# EAGLE design p8x-regbank-card (EAGLE 9.6.2)
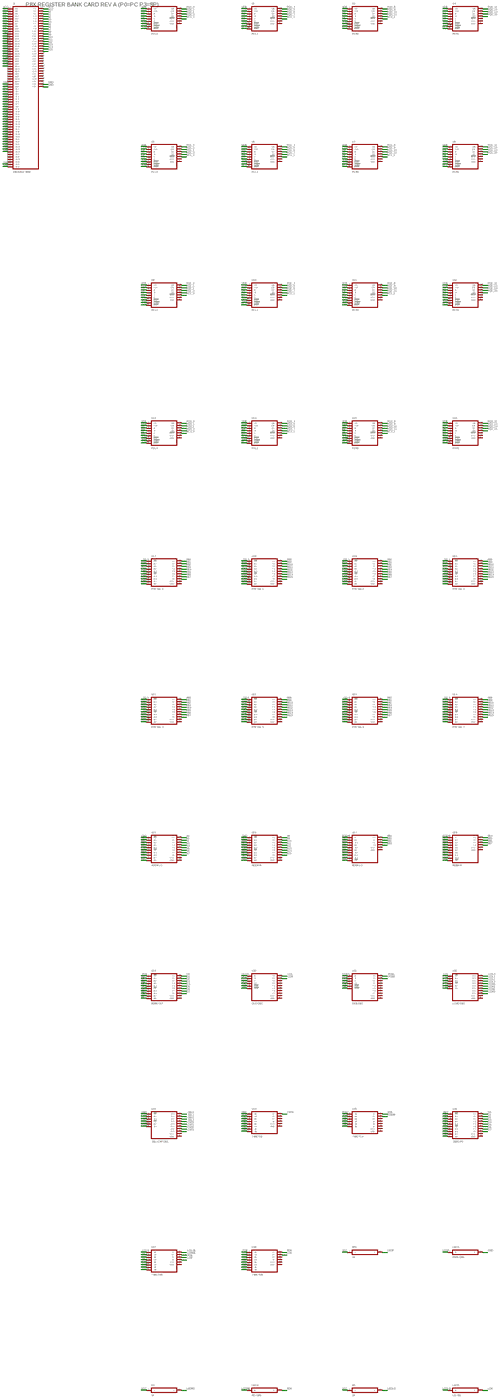
[diagram p0: schematic, sheet 1, overview]
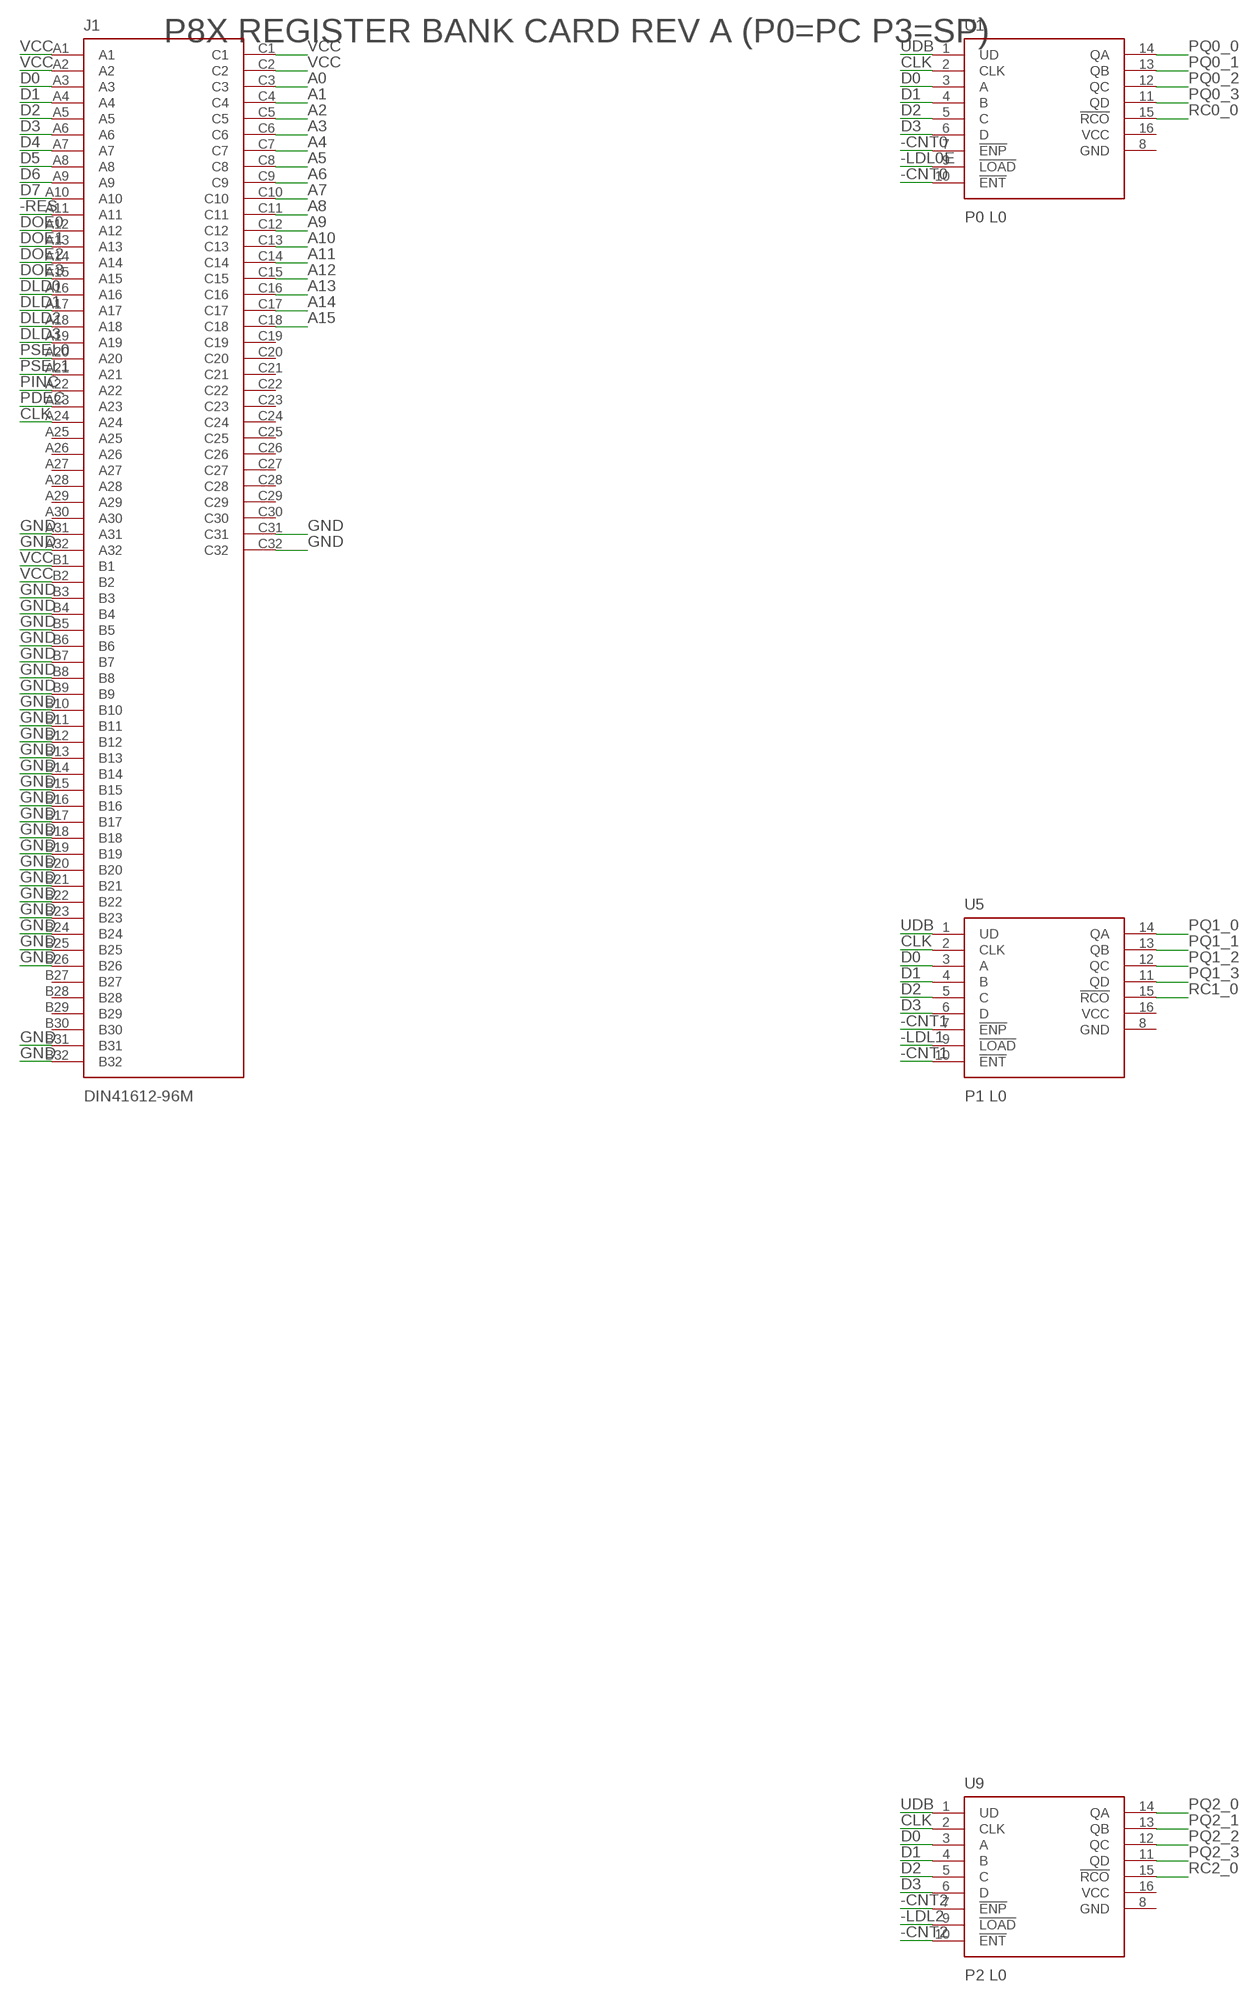
[diagram p1: schematic, sheet 1, part 1 of 5]
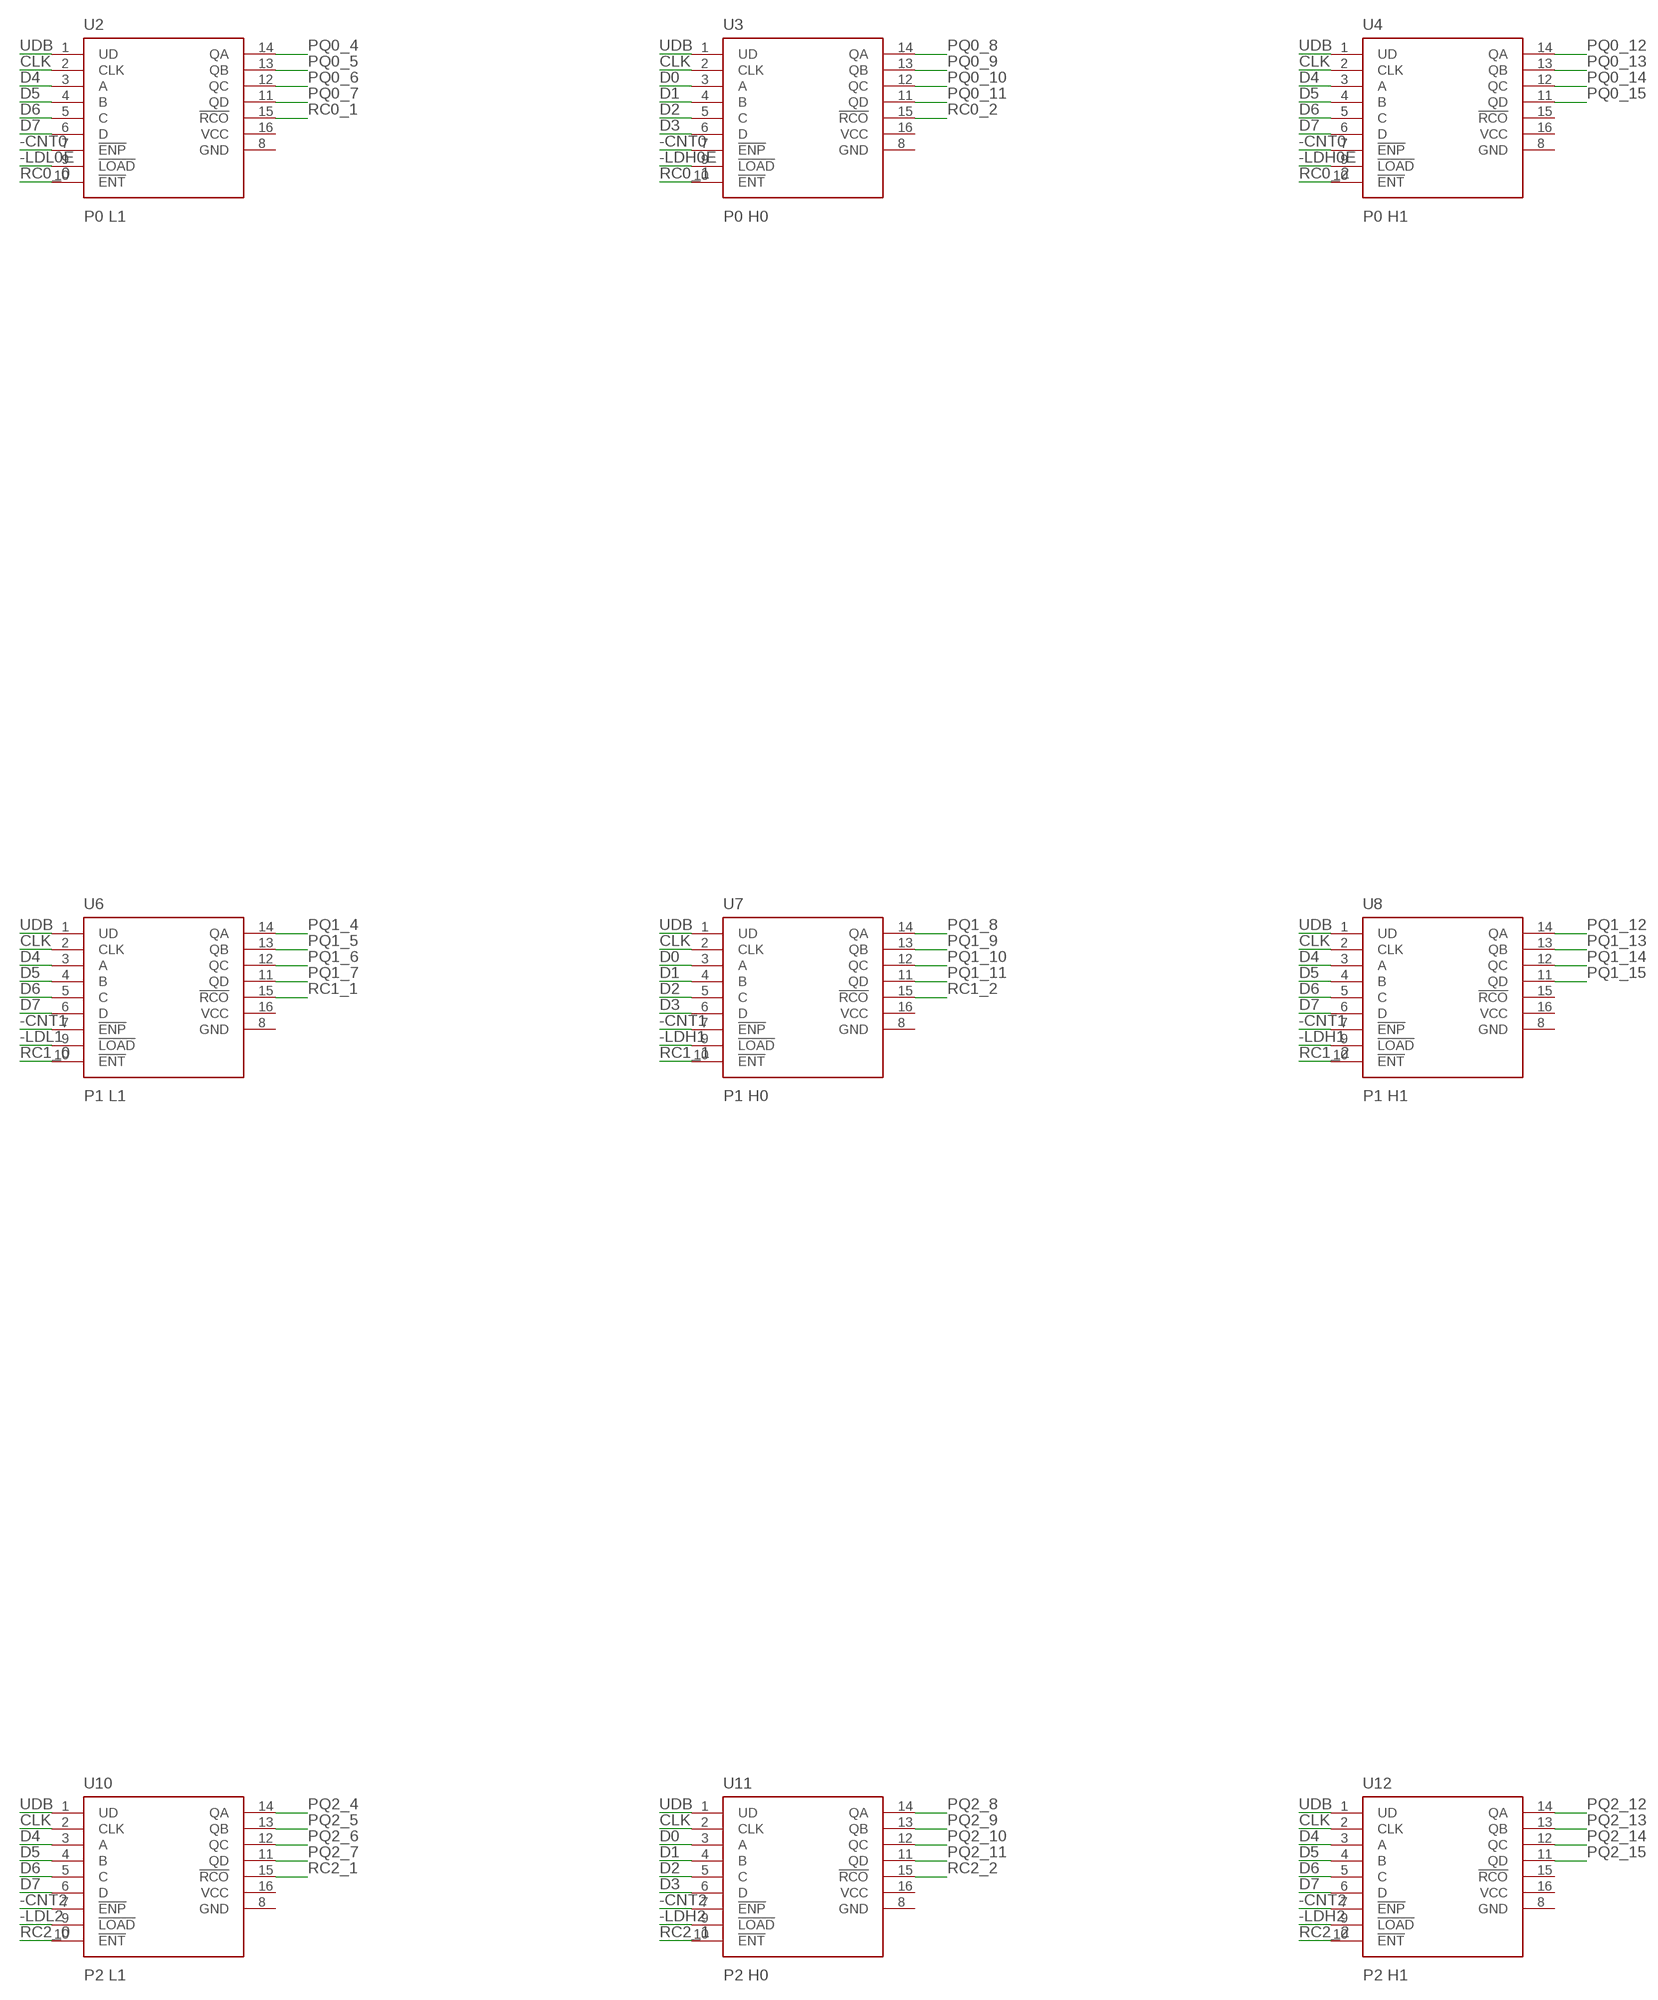
[diagram p2: schematic, sheet 1, part 2 of 5]
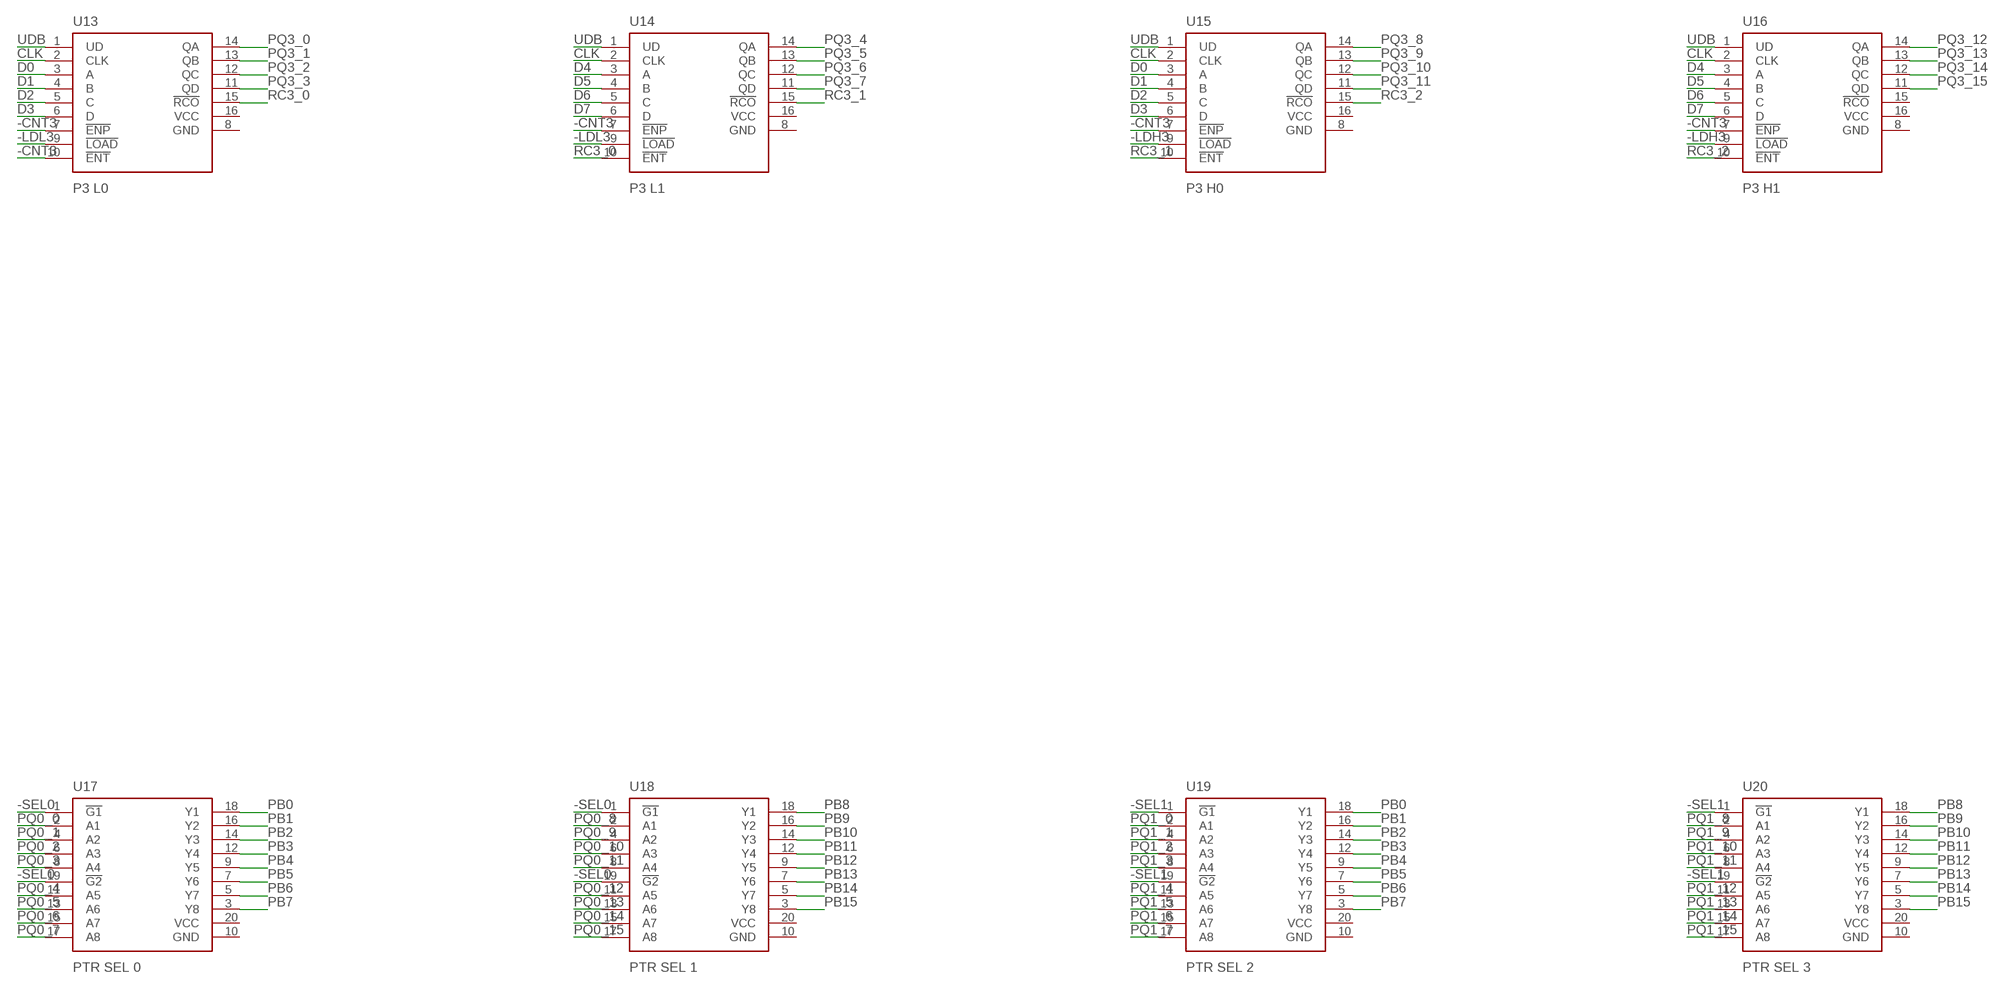
[diagram p3: schematic, sheet 1, part 3 of 5]
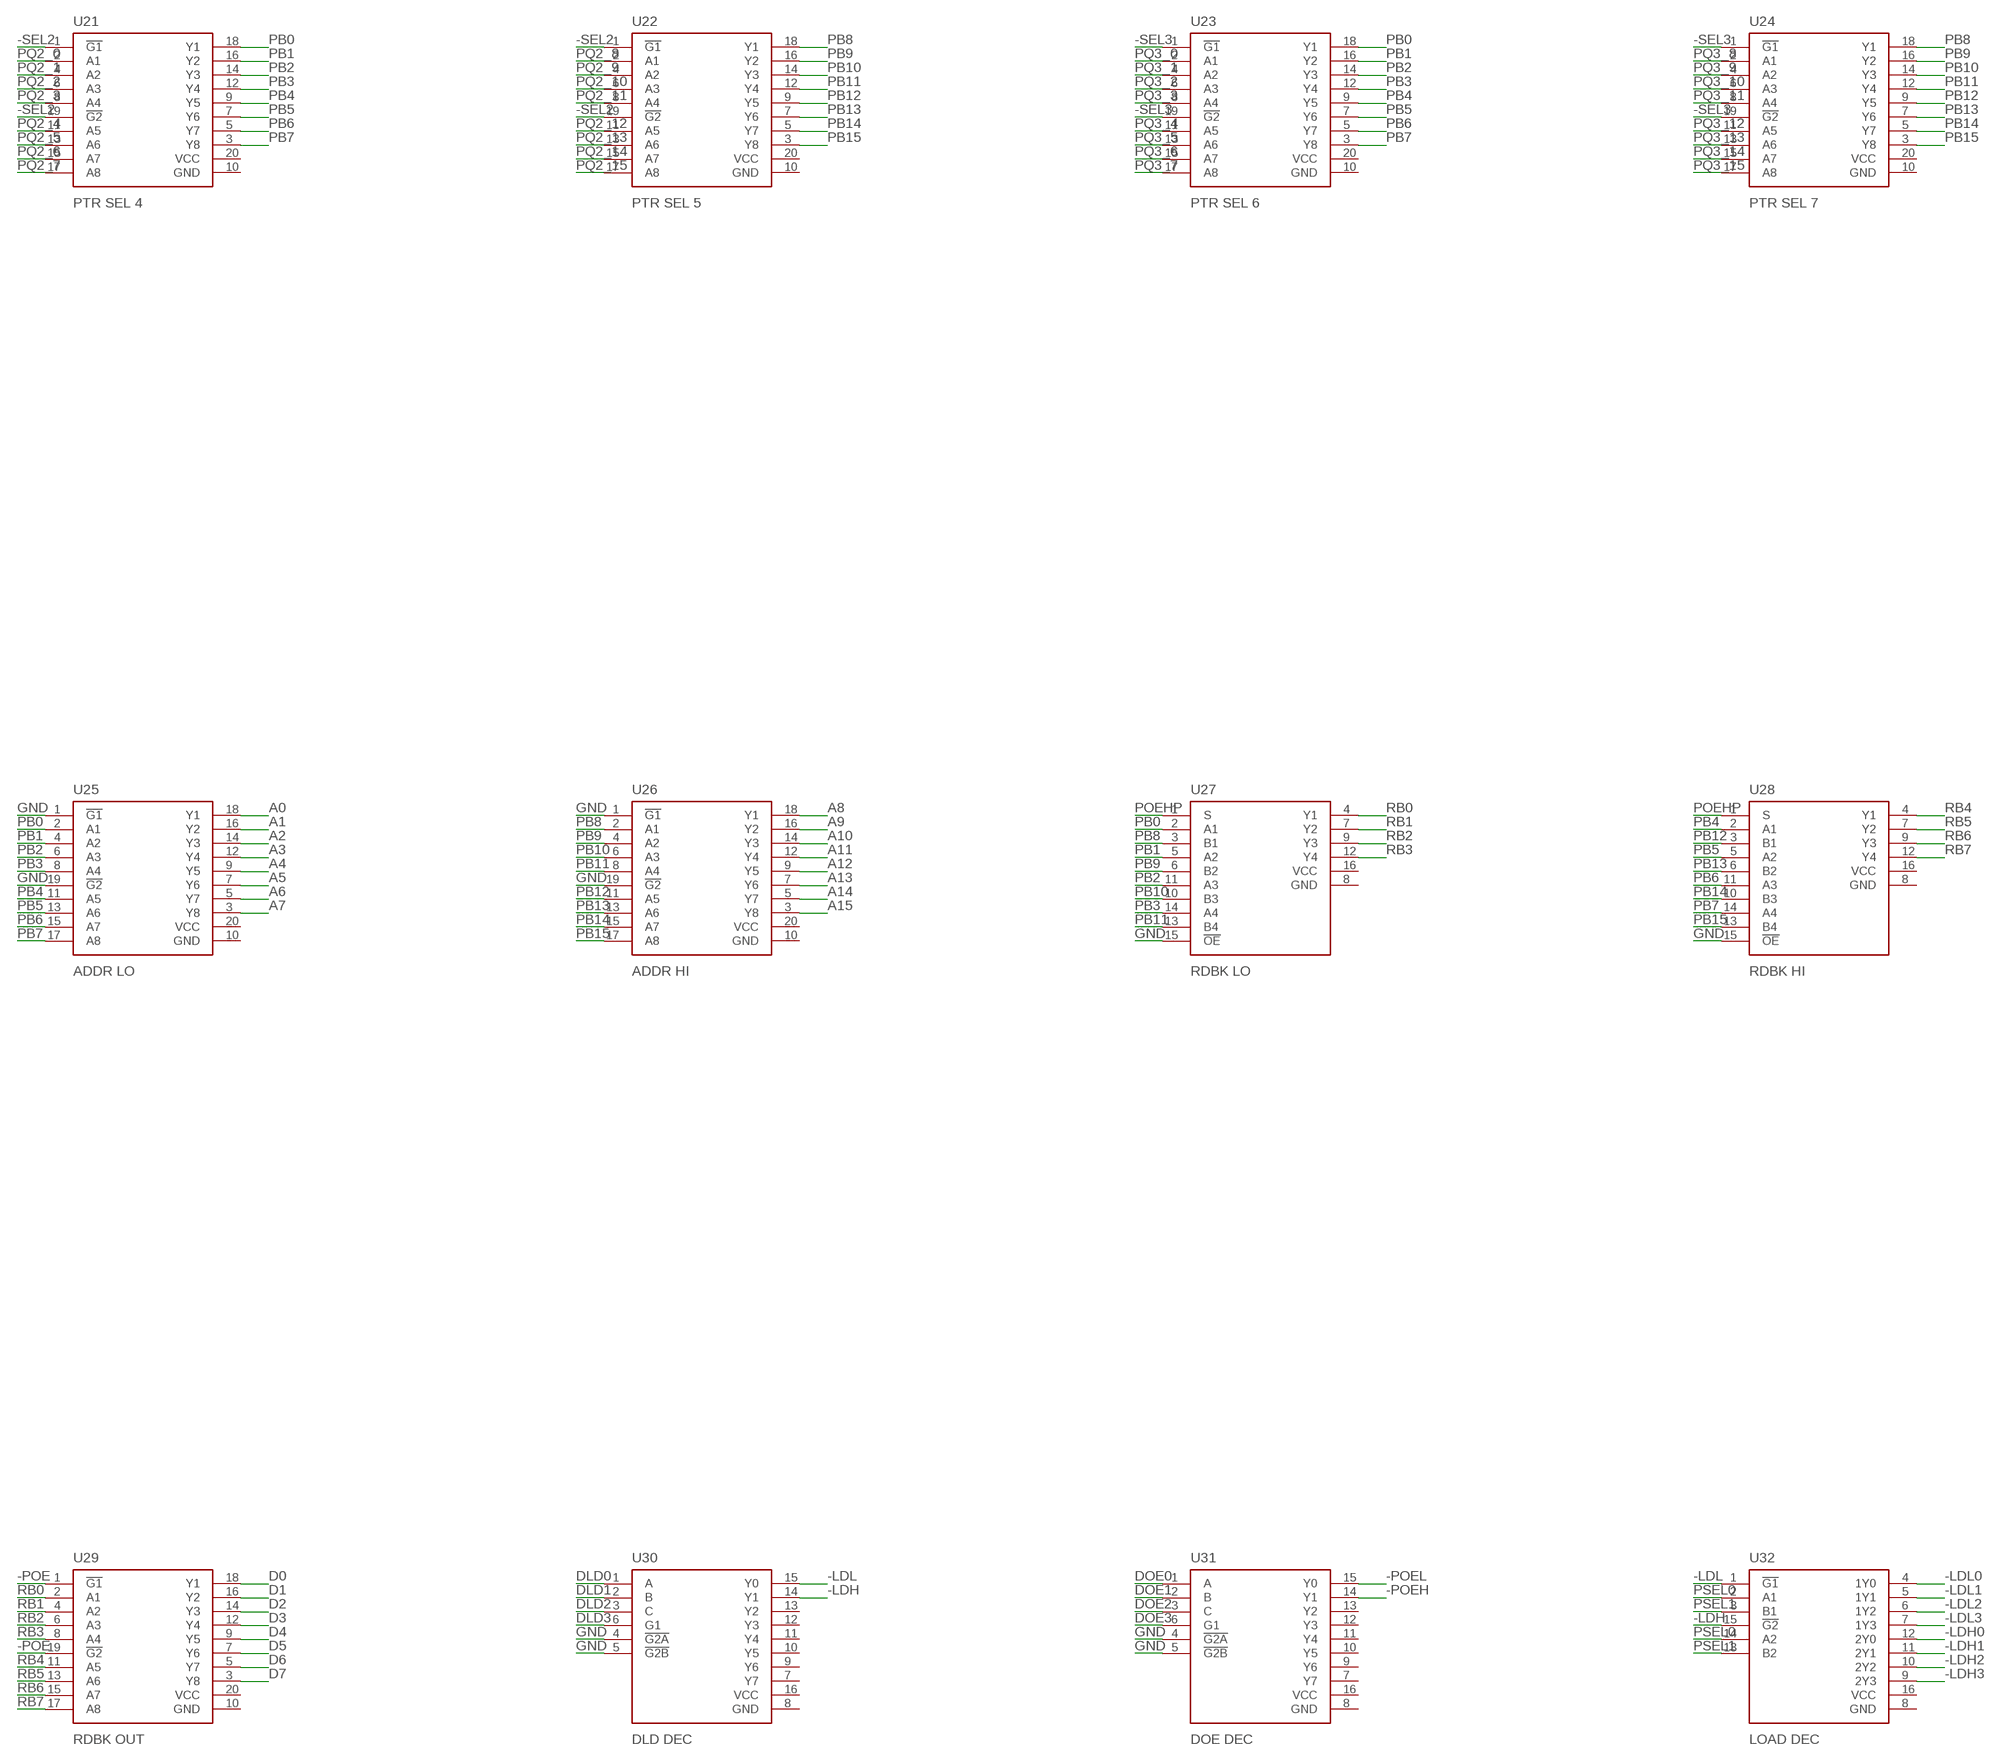
[diagram p4: schematic, sheet 1, part 4 of 5]
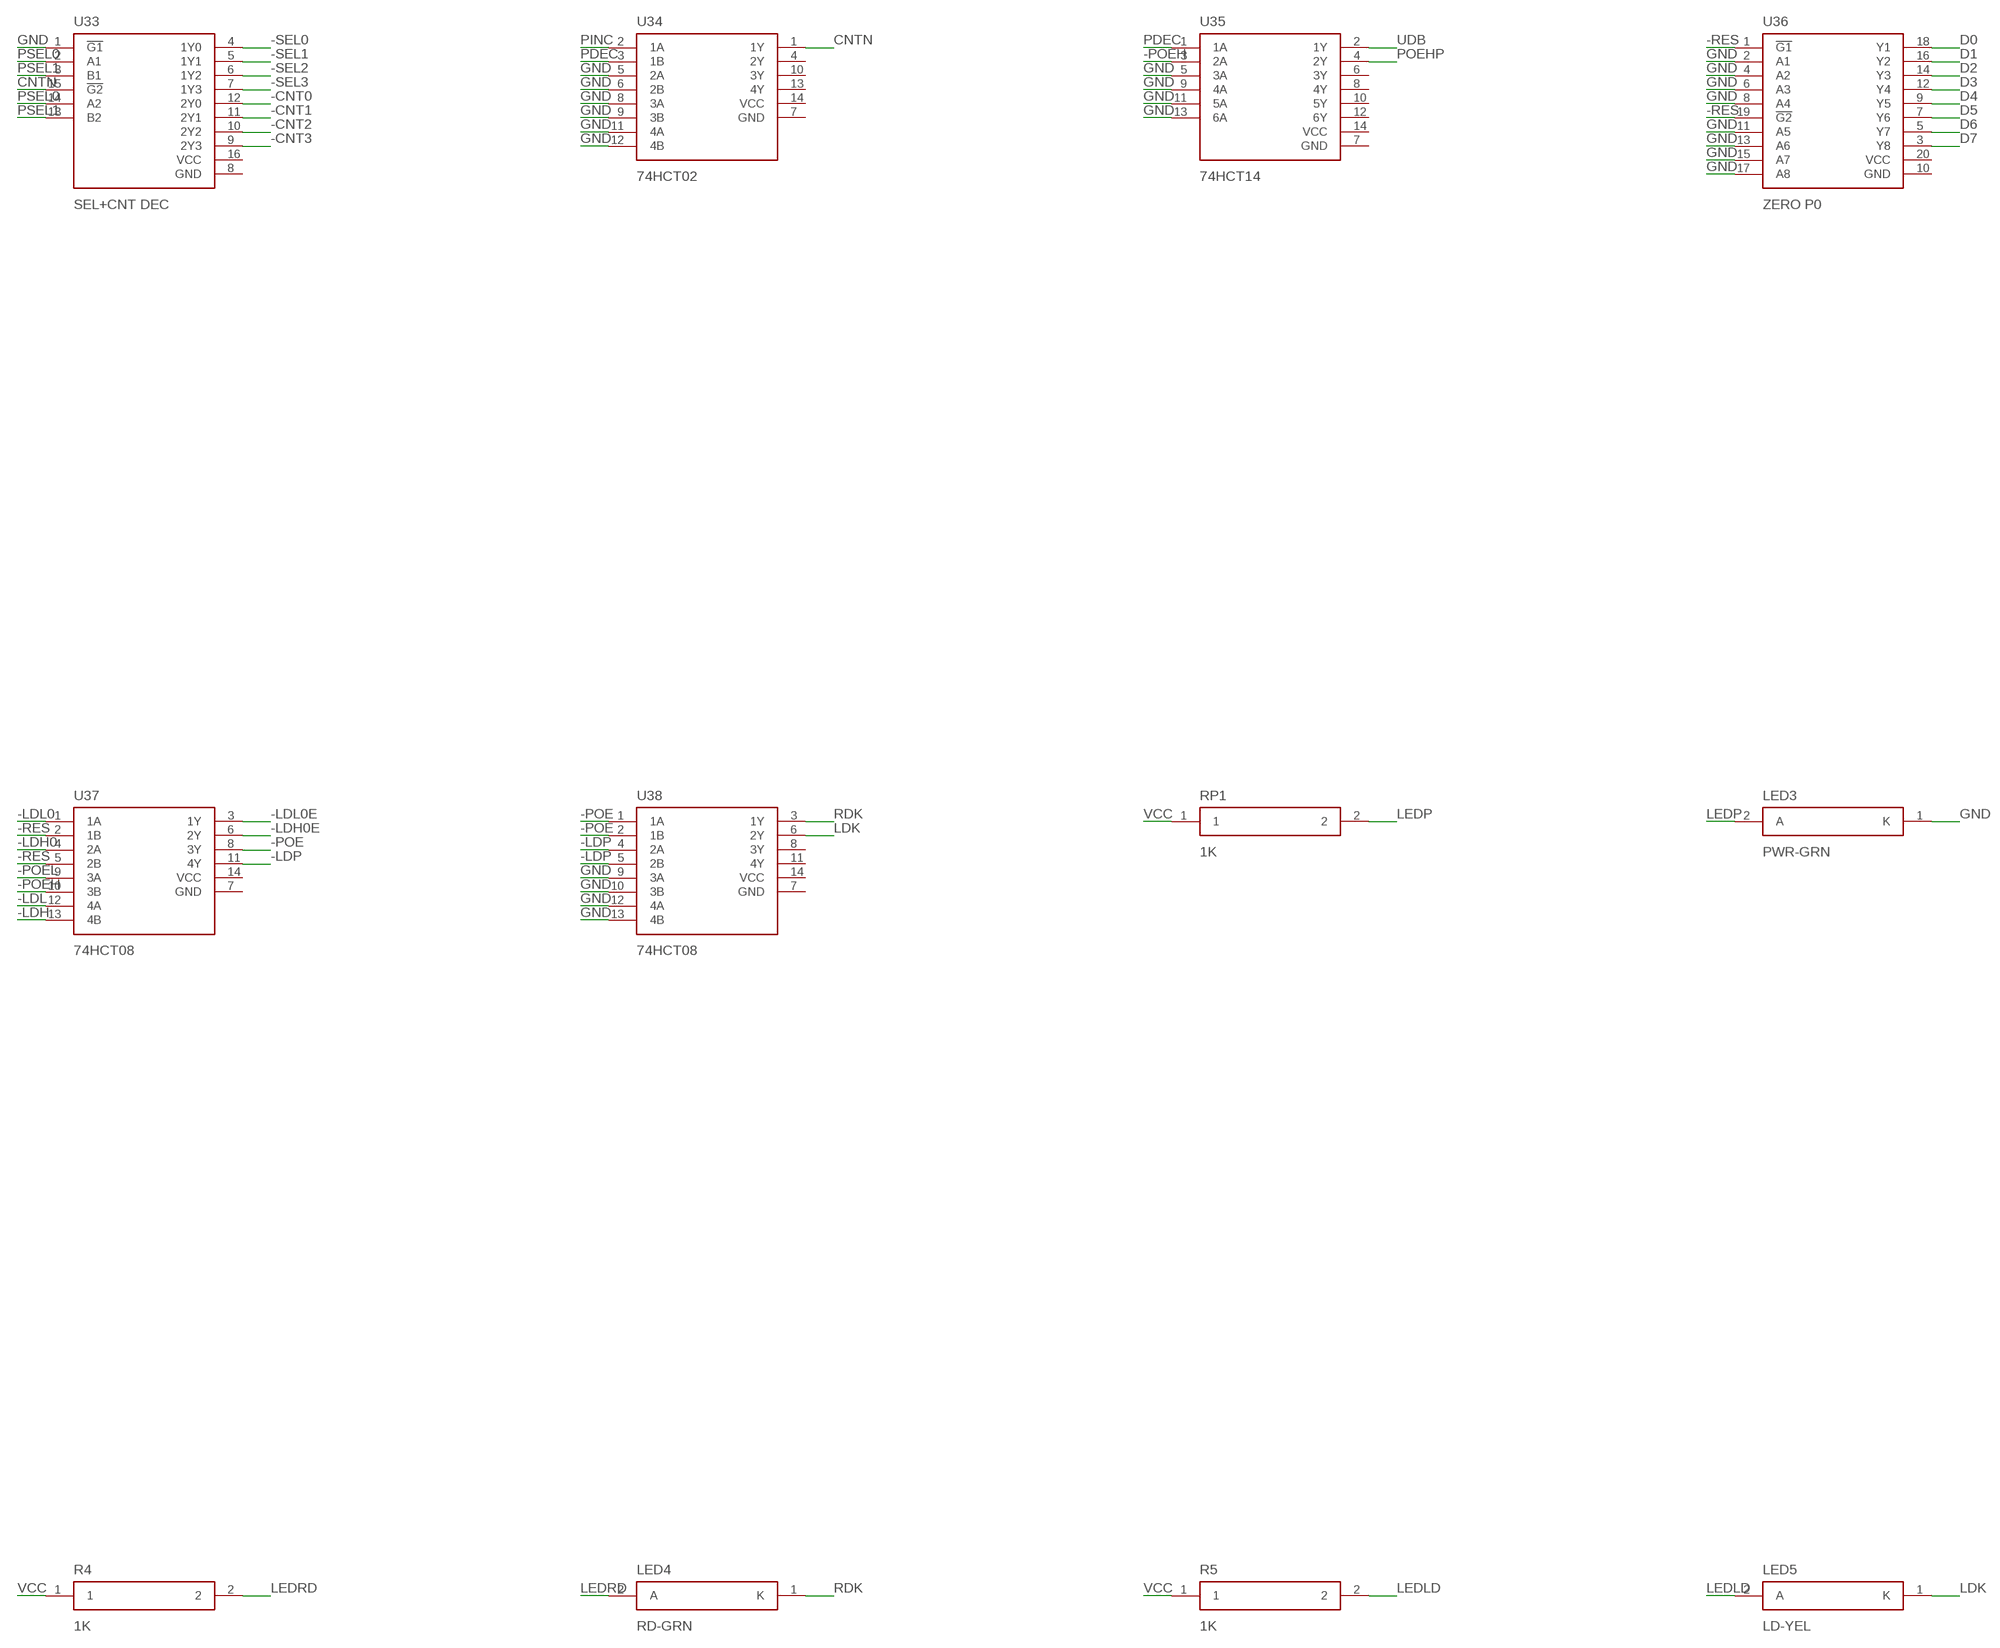
[diagram p5: schematic, sheet 1, part 5 of 5]

## Parts
J1  DIN41612-96M  DIN96  [DIN96]
LED3  PWR-GRN  LED  [LED5]
LED4  RD-GRN  LED  [LED5]
LED5  LD-YEL  LED  [LED5]
R4  1K  RES  [R_AXIAL]
R5  1K  RES  [R_AXIAL]
RP1  1K  RES  [R_AXIAL]
U1  P0 L0  74169  [DIP16]
U2  P0 L1  74169  [DIP16]
U3  P0 H0  74169  [DIP16]
U4  P0 H1  74169  [DIP16]
U5  P1 L0  74169  [DIP16]
U6  P1 L1  74169  [DIP16]
U7  P1 H0  74169  [DIP16]
U8  P1 H1  74169  [DIP16]
U9  P2 L0  74169  [DIP16]
U10  P2 L1  74169  [DIP16]
U11  P2 H0  74169  [DIP16]
U12  P2 H1  74169  [DIP16]
U13  P3 L0  74169  [DIP16]
U14  P3 L1  74169  [DIP16]
U15  P3 H0  74169  [DIP16]
U16  P3 H1  74169  [DIP16]
U17  PTR SEL 0  74244  [DIP20]
U18  PTR SEL 1  74244  [DIP20]
U19  PTR SEL 2  74244  [DIP20]
U20  PTR SEL 3  74244  [DIP20]
U21  PTR SEL 4  74244  [DIP20]
U22  PTR SEL 5  74244  [DIP20]
U23  PTR SEL 6  74244  [DIP20]
U24  PTR SEL 7  74244  [DIP20]
U25  ADDR LO  74244  [DIP20]
U26  ADDR HI  74244  [DIP20]
U27  RDBK LO  74257  [DIP16]
U28  RDBK HI  74257  [DIP16]
U29  RDBK OUT  74244  [DIP20]
U30  DLD DEC  74138  [DIP16]
U31  DOE DEC  74138  [DIP16]
U32  LOAD DEC  74139  [DIP16]
U33  SEL+CNT DEC  74139  [DIP16]
U34  74HCT02  7402  [DIP14]
U35  74HCT14  HEX14  [DIP14]
U36  ZERO P0  74244  [DIP20]
U37  74HCT08  GATES14  [DIP14]
U38  74HCT08  GATES14  [DIP14]

## Nets
-CNT0: U1.7(!ENP) U1.10(!ENT) U2.7(!ENP) U3.7(!ENP) U4.7(!ENP) U33.12(2Y0)
-CNT1: U5.7(!ENP) U5.10(!ENT) U6.7(!ENP) U7.7(!ENP) U8.7(!ENP) U33.11(2Y1)
-CNT2: U9.7(!ENP) U9.10(!ENT) U10.7(!ENP) U11.7(!ENP) U12.7(!ENP) U33.10(2Y2)
-CNT3: U13.7(!ENP) U13.10(!ENT) U14.7(!ENP) U15.7(!ENP) U16.7(!ENP) U33.9(2Y3)
-LDH: U30.14(Y1) U32.15(!G2) U37.13(4B)
-LDH0: U32.12(2Y0) U37.4(2A)
-LDH0E: U3.9(!LOAD) U4.9(!LOAD) U37.6(2Y)
-LDH1: U7.9(!LOAD) U8.9(!LOAD) U32.11(2Y1)
-LDH2: U11.9(!LOAD) U12.9(!LOAD) U32.10(2Y2)
-LDH3: U15.9(!LOAD) U16.9(!LOAD) U32.9(2Y3)
-LDL: U30.15(Y0) U32.1(!G1) U37.12(4A)
-LDL0: U32.4(1Y0) U37.1(1A)
-LDL0E: U1.9(!LOAD) U2.9(!LOAD) U37.3(1Y)
-LDL1: U5.9(!LOAD) U6.9(!LOAD) U32.5(1Y1)
-LDL2: U9.9(!LOAD) U10.9(!LOAD) U32.6(1Y2)
-LDL3: U13.9(!LOAD) U14.9(!LOAD) U32.7(1Y3)
-LDP: U37.11(4Y) U38.4(2A) U38.5(2B)
-POE: U29.1(!G1) U29.19(!G2) U37.8(3Y) U38.1(1A) U38.2(1B)
-POEH: U31.14(Y1) U35.3(2A) U37.10(3B)
-POEL: U31.15(Y0) U37.9(3A)
-RES: J1.A11 U36.1(!G1) U36.19(!G2) U37.2(1B) U37.5(2B)
-SEL0: U17.1(!G1) U17.19(!G2) U18.1(!G1) U18.19(!G2) U33.4(1Y0)
-SEL1: U19.1(!G1) U19.19(!G2) U20.1(!G1) U20.19(!G2) U33.5(1Y1)
-SEL2: U21.1(!G1) U21.19(!G2) U22.1(!G1) U22.19(!G2) U33.6(1Y2)
-SEL3: U23.1(!G1) U23.19(!G2) U24.1(!G1) U24.19(!G2) U33.7(1Y3)
A0: J1.C3 U25.18(Y1)
A1: J1.C4 U25.16(Y2)
A2: J1.C5 U25.14(Y3)
A3: J1.C6 U25.12(Y4)
A4: J1.C7 U25.9(Y5)
A5: J1.C8 U25.7(Y6)
A6: J1.C9 U25.5(Y7)
A7: J1.C10 U25.3(Y8)
A8: J1.C11 U26.18(Y1)
A9: J1.C12 U26.16(Y2)
A10: J1.C13 U26.14(Y3)
A11: J1.C14 U26.12(Y4)
A12: J1.C15 U26.9(Y5)
A13: J1.C16 U26.7(Y6)
A14: J1.C17 U26.5(Y7)
A15: J1.C18 U26.3(Y8)
CLK: J1.A24 U1.2(CLK) U2.2(CLK) U3.2(CLK) U4.2(CLK) U5.2(CLK) U6.2(CLK) U7.2(CLK) U8.2(CLK) U9.2(CLK) U10.2(CLK) U11.2(CLK) U12.2(CLK) U13.2(CLK) U14.2(CLK) U15.2(CLK) U16.2(CLK)
CNTN: U33.15(!G2) U34.1(1Y)
D0: J1.A3 U1.3(A) U3.3(A) U5.3(A) U7.3(A) U9.3(A) U11.3(A) U13.3(A) U15.3(A) U29.18(Y1) U36.18(Y1)
D1: J1.A4 U1.4(B) U3.4(B) U5.4(B) U7.4(B) U9.4(B) U11.4(B) U13.4(B) U15.4(B) U29.16(Y2) U36.16(Y2)
D2: J1.A5 U1.5(C) U3.5(C) U5.5(C) U7.5(C) U9.5(C) U11.5(C) U13.5(C) U15.5(C) U29.14(Y3) U36.14(Y3)
D3: J1.A6 U1.6(D) U3.6(D) U5.6(D) U7.6(D) U9.6(D) U11.6(D) U13.6(D) U15.6(D) U29.12(Y4) U36.12(Y4)
D4: J1.A7 U2.3(A) U4.3(A) U6.3(A) U8.3(A) U10.3(A) U12.3(A) U14.3(A) U16.3(A) U29.9(Y5) U36.9(Y5)
D5: J1.A8 U2.4(B) U4.4(B) U6.4(B) U8.4(B) U10.4(B) U12.4(B) U14.4(B) U16.4(B) U29.7(Y6) U36.7(Y6)
D6: J1.A9 U2.5(C) U4.5(C) U6.5(C) U8.5(C) U10.5(C) U12.5(C) U14.5(C) U16.5(C) U29.5(Y7) U36.5(Y7)
D7: J1.A10 U2.6(D) U4.6(D) U6.6(D) U8.6(D) U10.6(D) U12.6(D) U14.6(D) U16.6(D) U29.3(Y8) U36.3(Y8)
DLD0: J1.A16 U30.1(A)
DLD1: J1.A17 U30.2(B)
DLD2: J1.A18 U30.3(C)
DLD3: J1.A19 U30.6(G1)
DOE0: J1.A12 U31.1(A)
DOE1: J1.A13 U31.2(B)
DOE2: J1.A14 U31.3(C)
DOE3: J1.A15 U31.6(G1)
GND: J1.A31 J1.A32 J1.B3 J1.B4 J1.B5 J1.B6 J1.B7 J1.B8 J1.B9 J1.B10 J1.B11 J1.B12 J1.B13 J1.B14 J1.B15 J1.B16 J1.B17 J1.B18 J1.B19 J1.B20 J1.B21 J1.B22 J1.B23 J1.B24 J1.B25 J1.B26 J1.B31 J1.B32 J1.C31 J1.C32 LED3.1(K) U25.1(!G1) U25.19(!G2) U26.1(!G1) U26.19(!G2) U27.15(!OE) U28.15(!OE) U30.4(!G2A) U30.5(!G2B) U31.4(!G2A) U31.5(!G2B) U33.1(!G1) U34.5(2A) U34.6(2B) U34.8(3A) U34.9(3B) U34.11(4A) U34.12(4B) U35.5(3A) U35.9(4A) U35.11(5A) U35.13(6A) U36.2(A1) U36.4(A2) U36.6(A3) U36.8(A4) U36.11(A5) U36.13(A6) U36.15(A7) U36.17(A8) U38.9(3A) U38.10(3B) U38.12(4A) U38.13(4B)
LDK: LED5.1(K) U38.6(2Y)
LEDLD: LED5.2(A) R5.2
LEDP: LED3.2(A) RP1.2
LEDRD: LED4.2(A) R4.2
PB0: U17.18(Y1) U19.18(Y1) U21.18(Y1) U23.18(Y1) U25.2(A1) U27.2(A1)
PB1: U17.16(Y2) U19.16(Y2) U21.16(Y2) U23.16(Y2) U25.4(A2) U27.5(A2)
PB2: U17.14(Y3) U19.14(Y3) U21.14(Y3) U23.14(Y3) U25.6(A3) U27.11(A3)
PB3: U17.12(Y4) U19.12(Y4) U21.12(Y4) U23.12(Y4) U25.8(A4) U27.14(A4)
PB4: U17.9(Y5) U19.9(Y5) U21.9(Y5) U23.9(Y5) U25.11(A5) U28.2(A1)
PB5: U17.7(Y6) U19.7(Y6) U21.7(Y6) U23.7(Y6) U25.13(A6) U28.5(A2)
PB6: U17.5(Y7) U19.5(Y7) U21.5(Y7) U23.5(Y7) U25.15(A7) U28.11(A3)
PB7: U17.3(Y8) U19.3(Y8) U21.3(Y8) U23.3(Y8) U25.17(A8) U28.14(A4)
PB8: U18.18(Y1) U20.18(Y1) U22.18(Y1) U24.18(Y1) U26.2(A1) U27.3(B1)
PB9: U18.16(Y2) U20.16(Y2) U22.16(Y2) U24.16(Y2) U26.4(A2) U27.6(B2)
PB10: U18.14(Y3) U20.14(Y3) U22.14(Y3) U24.14(Y3) U26.6(A3) U27.10(B3)
PB11: U18.12(Y4) U20.12(Y4) U22.12(Y4) U24.12(Y4) U26.8(A4) U27.13(B4)
PB12: U18.9(Y5) U20.9(Y5) U22.9(Y5) U24.9(Y5) U26.11(A5) U28.3(B1)
PB13: U18.7(Y6) U20.7(Y6) U22.7(Y6) U24.7(Y6) U26.13(A6) U28.6(B2)
PB14: U18.5(Y7) U20.5(Y7) U22.5(Y7) U24.5(Y7) U26.15(A7) U28.10(B3)
PB15: U18.3(Y8) U20.3(Y8) U22.3(Y8) U24.3(Y8) U26.17(A8) U28.13(B4)
PDEC: J1.A23 U34.3(1B) U35.1(1A)
PINC: J1.A22 U34.2(1A)
POEHP: U27.1(S) U28.1(S) U35.4(2Y)
PQ0_0: U1.14(QA) U17.2(A1)
PQ0_1: U1.13(QB) U17.4(A2)
PQ0_2: U1.12(QC) U17.6(A3)
PQ0_3: U1.11(QD) U17.8(A4)
PQ0_4: U2.14(QA) U17.11(A5)
PQ0_5: U2.13(QB) U17.13(A6)
PQ0_6: U2.12(QC) U17.15(A7)
PQ0_7: U2.11(QD) U17.17(A8)
PQ0_8: U3.14(QA) U18.2(A1)
PQ0_9: U3.13(QB) U18.4(A2)
PQ0_10: U3.12(QC) U18.6(A3)
PQ0_11: U3.11(QD) U18.8(A4)
PQ0_12: U4.14(QA) U18.11(A5)
PQ0_13: U4.13(QB) U18.13(A6)
PQ0_14: U4.12(QC) U18.15(A7)
PQ0_15: U4.11(QD) U18.17(A8)
PQ1_0: U5.14(QA) U19.2(A1)
PQ1_1: U5.13(QB) U19.4(A2)
PQ1_2: U5.12(QC) U19.6(A3)
PQ1_3: U5.11(QD) U19.8(A4)
PQ1_4: U6.14(QA) U19.11(A5)
PQ1_5: U6.13(QB) U19.13(A6)
PQ1_6: U6.12(QC) U19.15(A7)
PQ1_7: U6.11(QD) U19.17(A8)
PQ1_8: U7.14(QA) U20.2(A1)
PQ1_9: U7.13(QB) U20.4(A2)
PQ1_10: U7.12(QC) U20.6(A3)
PQ1_11: U7.11(QD) U20.8(A4)
PQ1_12: U8.14(QA) U20.11(A5)
PQ1_13: U8.13(QB) U20.13(A6)
PQ1_14: U8.12(QC) U20.15(A7)
PQ1_15: U8.11(QD) U20.17(A8)
PQ2_0: U9.14(QA) U21.2(A1)
PQ2_1: U9.13(QB) U21.4(A2)
PQ2_2: U9.12(QC) U21.6(A3)
PQ2_3: U9.11(QD) U21.8(A4)
PQ2_4: U10.14(QA) U21.11(A5)
PQ2_5: U10.13(QB) U21.13(A6)
PQ2_6: U10.12(QC) U21.15(A7)
PQ2_7: U10.11(QD) U21.17(A8)
PQ2_8: U11.14(QA) U22.2(A1)
PQ2_9: U11.13(QB) U22.4(A2)
PQ2_10: U11.12(QC) U22.6(A3)
PQ2_11: U11.11(QD) U22.8(A4)
PQ2_12: U12.14(QA) U22.11(A5)
PQ2_13: U12.13(QB) U22.13(A6)
PQ2_14: U12.12(QC) U22.15(A7)
PQ2_15: U12.11(QD) U22.17(A8)
PQ3_0: U13.14(QA) U23.2(A1)
PQ3_1: U13.13(QB) U23.4(A2)
PQ3_2: U13.12(QC) U23.6(A3)
PQ3_3: U13.11(QD) U23.8(A4)
PQ3_4: U14.14(QA) U23.11(A5)
PQ3_5: U14.13(QB) U23.13(A6)
PQ3_6: U14.12(QC) U23.15(A7)
PQ3_7: U14.11(QD) U23.17(A8)
PQ3_8: U15.14(QA) U24.2(A1)
PQ3_9: U15.13(QB) U24.4(A2)
PQ3_10: U15.12(QC) U24.6(A3)
PQ3_11: U15.11(QD) U24.8(A4)
PQ3_12: U16.14(QA) U24.11(A5)
PQ3_13: U16.13(QB) U24.13(A6)
PQ3_14: U16.12(QC) U24.15(A7)
PQ3_15: U16.11(QD) U24.17(A8)
PSEL0: J1.A20 U32.2(A1) U32.14(A2) U33.2(A1) U33.14(A2)
PSEL1: J1.A21 U32.3(B1) U32.13(B2) U33.3(B1) U33.13(B2)
RB0: U27.4(Y1) U29.2(A1)
RB1: U27.7(Y2) U29.4(A2)
RB2: U27.9(Y3) U29.6(A3)
RB3: U27.12(Y4) U29.8(A4)
RB4: U28.4(Y1) U29.11(A5)
RB5: U28.7(Y2) U29.13(A6)
RB6: U28.9(Y3) U29.15(A7)
RB7: U28.12(Y4) U29.17(A8)
RC0_0: U1.15(!RCO) U2.10(!ENT)
RC0_1: U2.15(!RCO) U3.10(!ENT)
RC0_2: U3.15(!RCO) U4.10(!ENT)
RC1_0: U5.15(!RCO) U6.10(!ENT)
RC1_1: U6.15(!RCO) U7.10(!ENT)
RC1_2: U7.15(!RCO) U8.10(!ENT)
RC2_0: U9.15(!RCO) U10.10(!ENT)
RC2_1: U10.15(!RCO) U11.10(!ENT)
RC2_2: U11.15(!RCO) U12.10(!ENT)
RC3_0: U13.15(!RCO) U14.10(!ENT)
RC3_1: U14.15(!RCO) U15.10(!ENT)
RC3_2: U15.15(!RCO) U16.10(!ENT)
RDK: LED4.1(K) U38.3(1Y)
UDB: U1.1(UD) U2.1(UD) U3.1(UD) U4.1(UD) U5.1(UD) U6.1(UD) U7.1(UD) U8.1(UD) U9.1(UD) U10.1(UD) U11.1(UD) U12.1(UD) U13.1(UD) U14.1(UD) U15.1(UD) U16.1(UD) U35.2(1Y)
VCC: J1.A1 J1.A2 J1.B1 J1.B2 J1.C1 J1.C2 R4.1 R5.1 RP1.1
Unconnected: J1.A25 J1.A26 J1.A27 J1.A28 J1.A29 J1.A30 J1.B27 J1.B28 J1.B29 J1.B30 J1.C19 J1.C20 J1.C21 J1.C22 J1.C23 J1.C24 J1.C25 J1.C26 J1.C27 J1.C28 J1.C29 J1.C30 U1.8(GND) U1.16(VCC) U2.8(GND) U2.16(VCC) U3.8(GND) U3.16(VCC) U4.8(GND) U4.15(!RCO) U4.16(VCC) U5.8(GND) U5.16(VCC) U6.8(GND) U6.16(VCC) U7.8(GND) U7.16(VCC) U8.8(GND) U8.15(!RCO) U8.16(VCC) U9.8(GND) U9.16(VCC) U10.8(GND) U10.16(VCC) U11.8(GND) U11.16(VCC) U12.8(GND) U12.15(!RCO) U12.16(VCC) U13.8(GND) U13.16(VCC) U14.8(GND) U14.16(VCC) U15.8(GND) U15.16(VCC) U16.8(GND) U16.15(!RCO) U16.16(VCC) U17.10(GND) U17.20(VCC) U18.10(GND) U18.20(VCC) U19.10(GND) U19.20(VCC) U20.10(GND) U20.20(VCC) U21.10(GND) U21.20(VCC) U22.10(GND) U22.20(VCC) U23.10(GND) U23.20(VCC) U24.10(GND) U24.20(VCC) U25.10(GND) U25.20(VCC) U26.10(GND) U26.20(VCC) U27.8(GND) U27.16(VCC) U28.8(GND) U28.16(VCC) U29.10(GND) U29.20(VCC) U30.7(Y7) U30.8(GND) U30.9(Y6) U30.10(Y5) U30.11(Y4) U30.12(Y3) U30.13(Y2) U30.16(VCC) U31.7(Y7) U31.8(GND) U31.9(Y6) U31.10(Y5) U31.11(Y4) U31.12(Y3) U31.13(Y2) U31.16(VCC) U32.8(GND) U32.16(VCC) U33.8(GND) U33.16(VCC) U34.4(2Y) U34.7(GND) U34.10(3Y) U34.13(4Y) U34.14(VCC) U35.6(3Y) U35.7(GND) U35.8(4Y) U35.10(5Y) U35.12(6Y) U35.14(VCC) U36.10(GND) U36.20(VCC) U37.7(GND) U37.14(VCC) U38.7(GND) U38.8(3Y) U38.11(4Y) U38.14(VCC)

## Notes on the sheet
- P8X REGISTER BANK CARD REV A (P0=PC P3=SP)

## Library data of the parts
J1 = p8x:DIN96
LED3-LED5 = p8x:LED
R4 R5 RP1 = p8x:RES
U1-U16 = p8x:74169
U17-U26 U29 U36 = p8x:74244
U27 U28 = p8x:74257
U30 U31 = p8x:74138
U32 U33 = p8x:74139
U34 = p8x:7402
U35 = p8x:HEX14
U37 U38 = p8x:GATES14

## Board
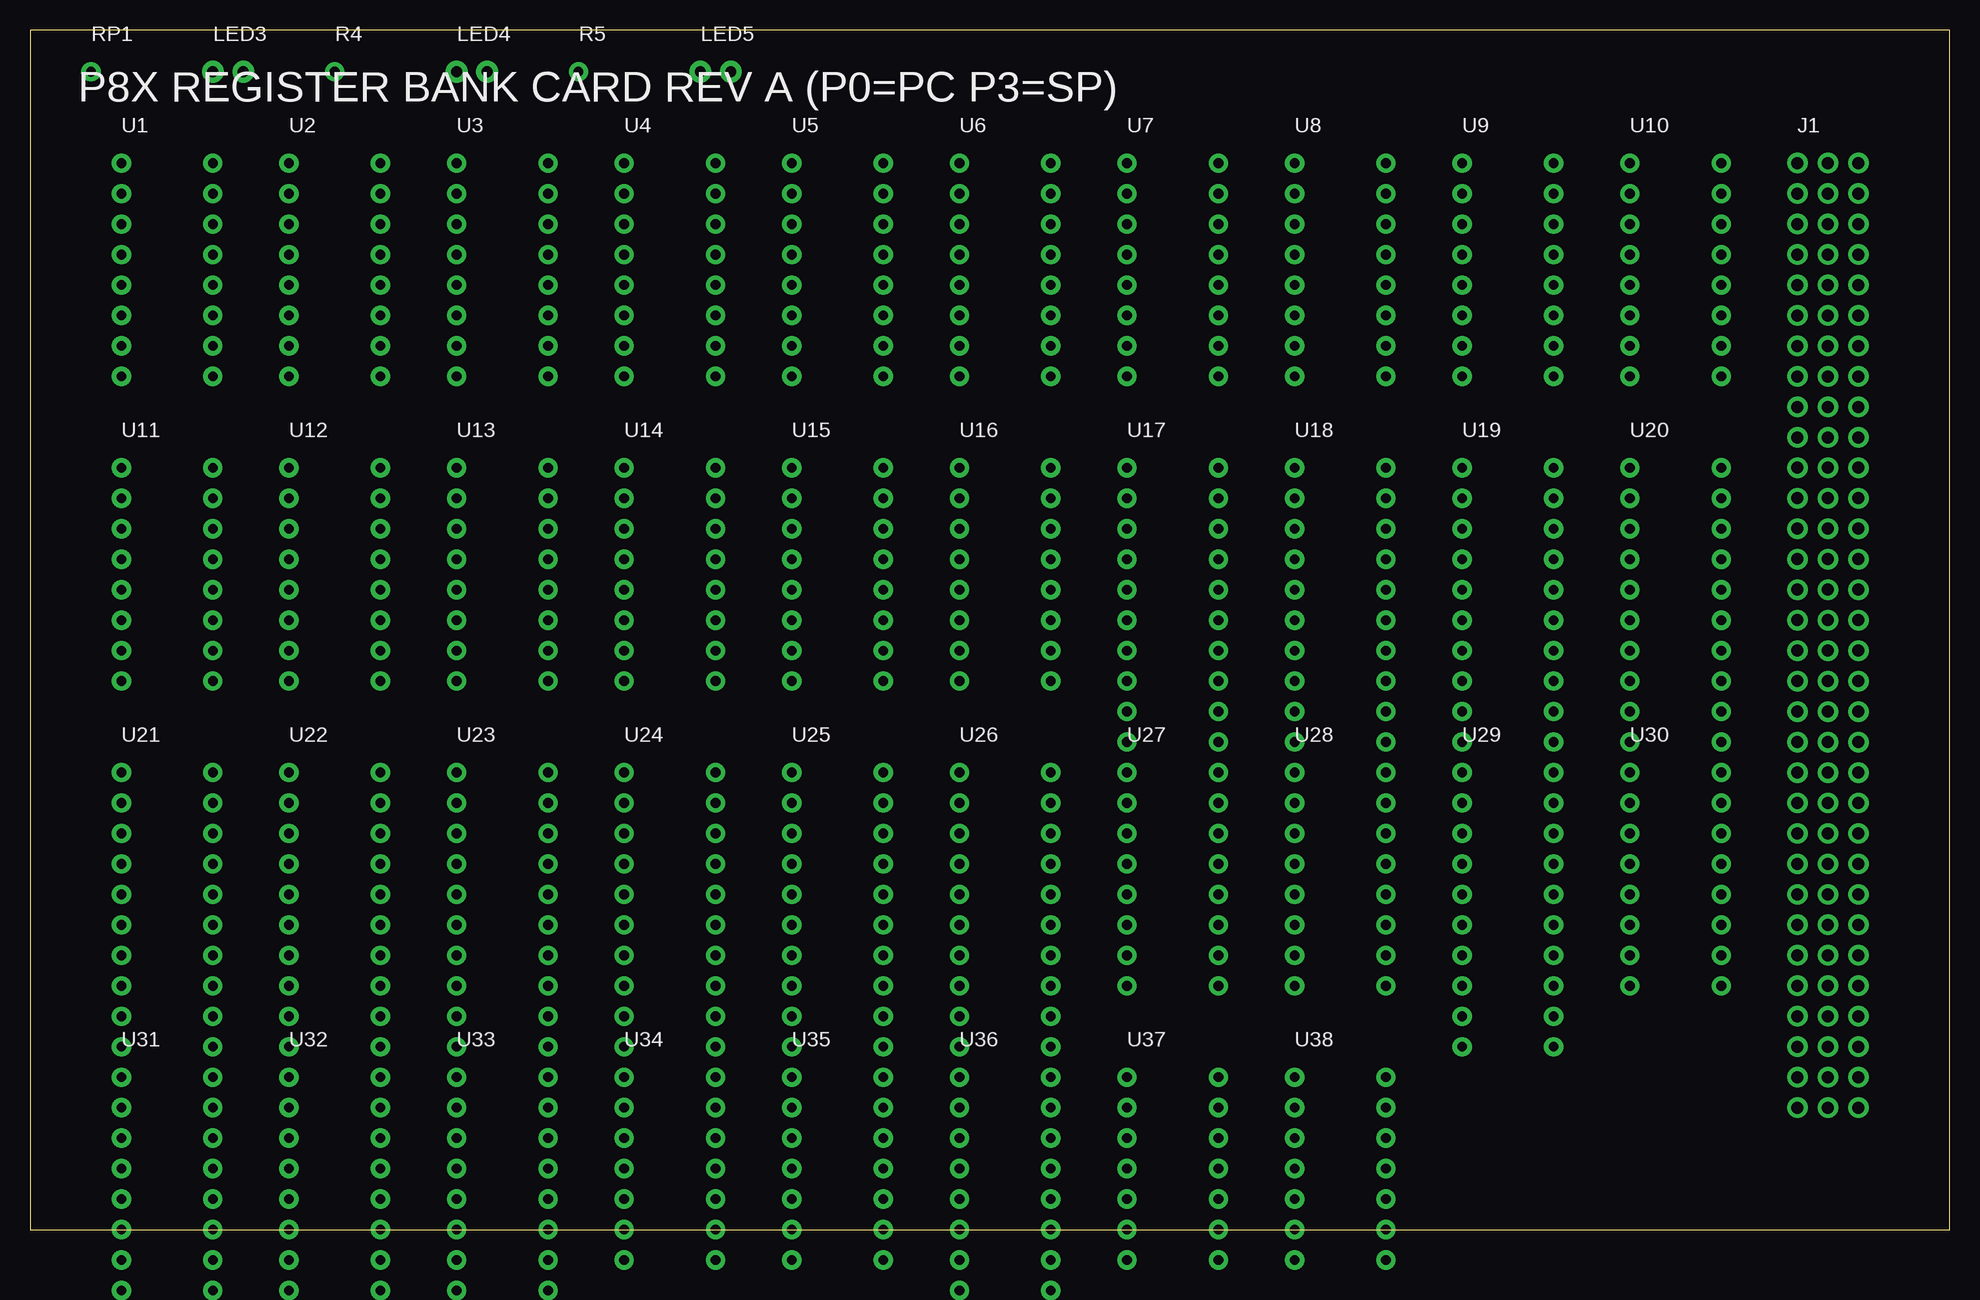
[diagram p6: board, top side]
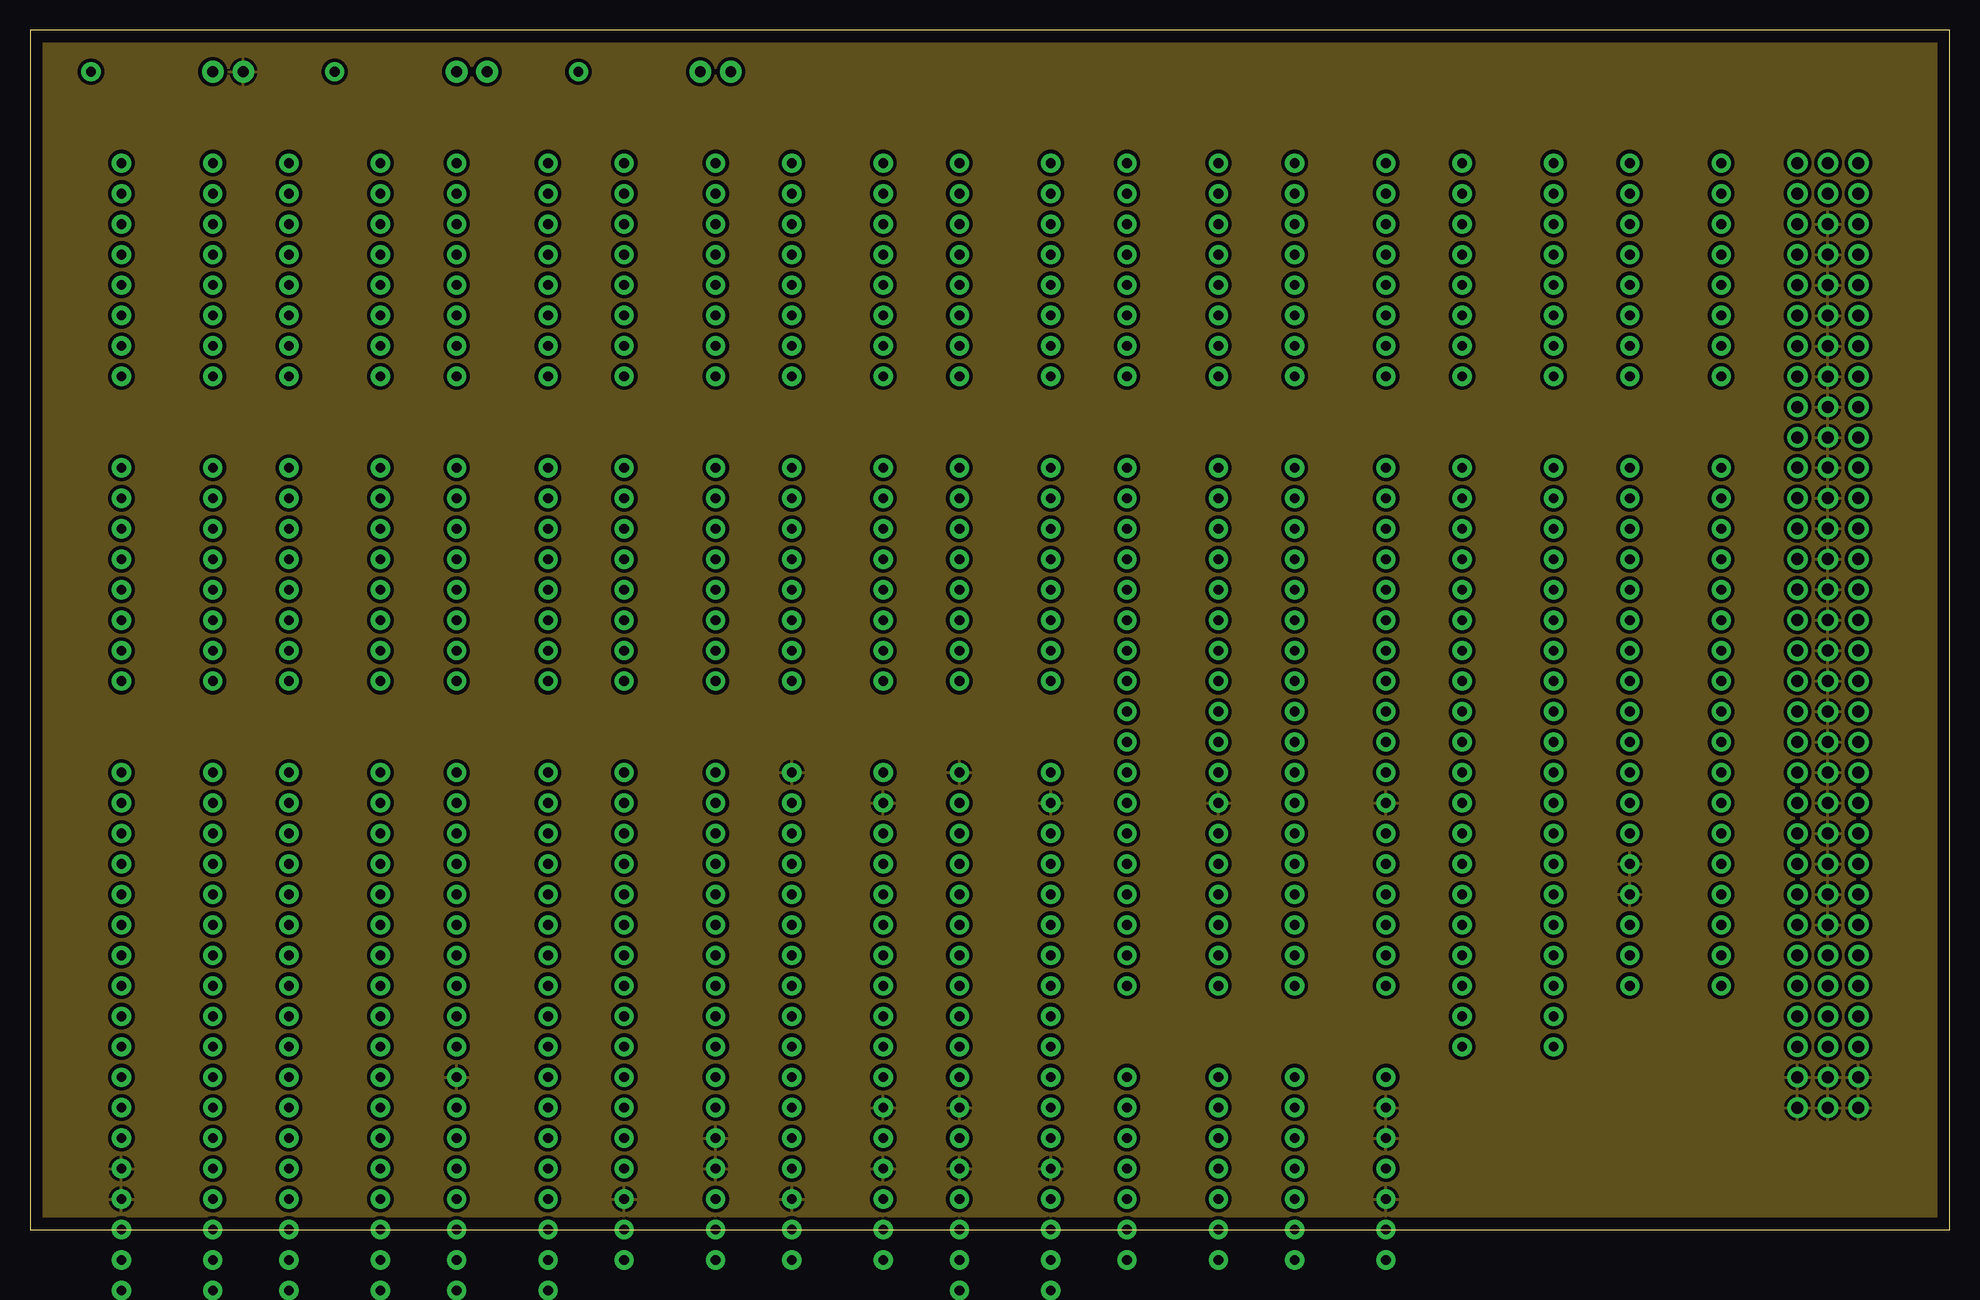
[diagram p7: board, inner layer Route2]
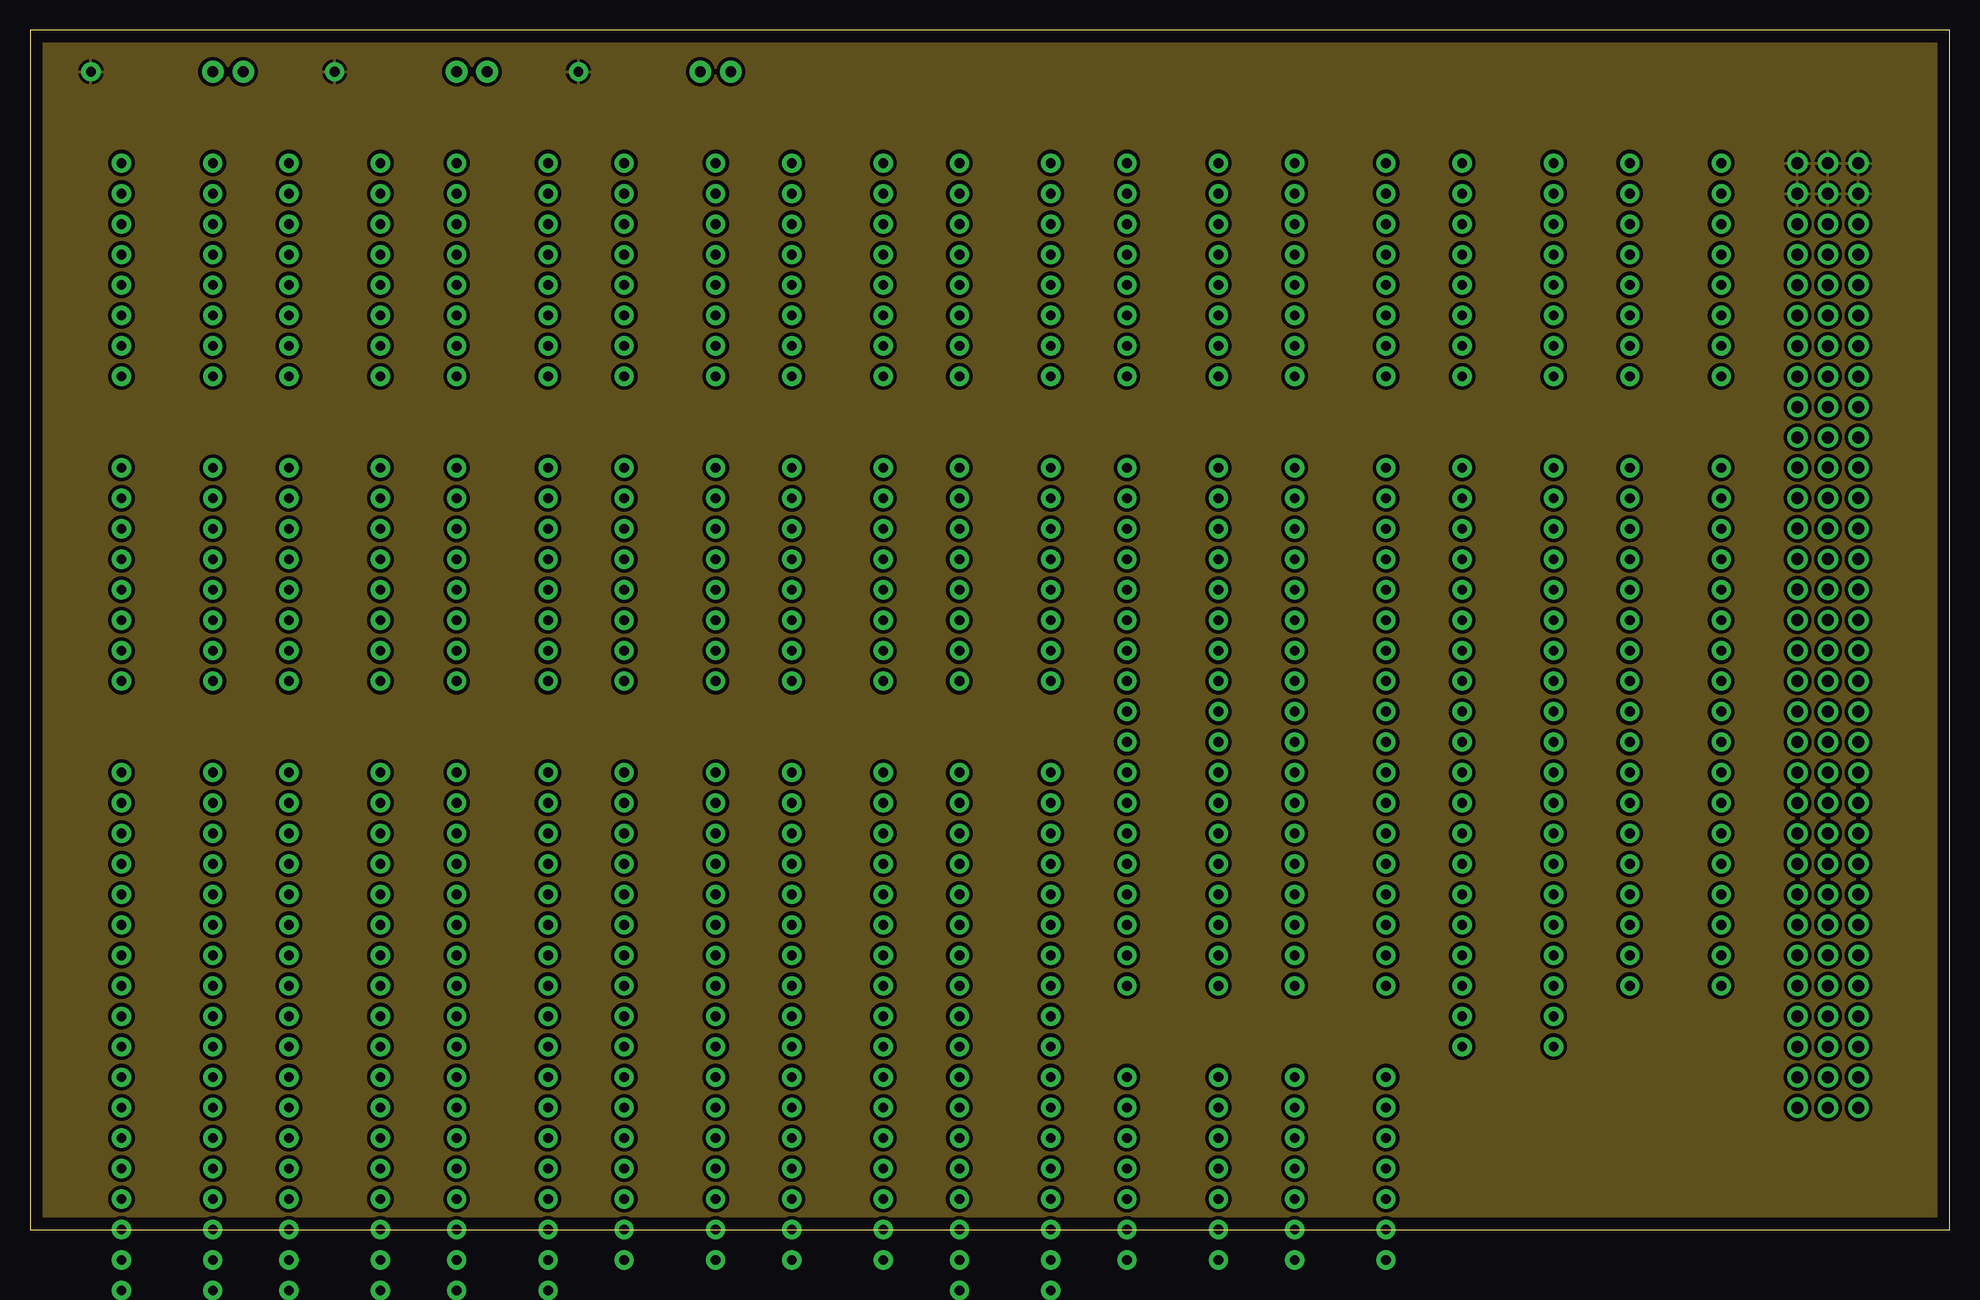
[diagram p8: board, inner layer Route15]

Size 160 x 100 mm. Coordinates in mm from the lower left corner, seen from the top.
Outline: 0,0 160,0 160,100 0,100 0,0
Copper layers (1*2*15*16): Top / Route2 / Route15 / Bottom

### Footprints (pad centres in the part's own frame; a part is rotated, then mirrored left to right if it is on the bottom)
DIN96 = drill 1 pad 1.7: A1 5.08,0; A2 5.08,-2.54; A3 5.08,-5.08; A4 5.08,-7.62; A5 5.08,-10.16; A6 5.08,-12.7; A7 5.08,-15.24; A8 5.08,-17.78; A9 5.08,-20.32; A10 5.08,-22.86; A11 5.08,-25.4; A12 5.08,-27.94; A13 5.08,-30.48; A14 5.08,-33.02; A15 5.08,-35.56; A16 5.08,-38.1; A17 5.08,-40.64; A18 5.08,-43.18; A19 5.08,-45.72; A20 5.08,-48.26; A21 5.08,-50.8; A22 5.08,-53.34; A23 5.08,-55.88; A24 5.08,-58.42; A25 5.08,-60.96; A26 5.08,-63.5; A27 5.08,-66.04; A28 5.08,-68.58; A29 5.08,-71.12; A30 5.08,-73.66; A31 5.08,-76.2; A32 5.08,-78.74; B1 2.54,0; B2 2.54,-2.54; B3 2.54,-5.08; B4 2.54,-7.62; B5 2.54,-10.16; B6 2.54,-12.7; B7 2.54,-15.24; B8 2.54,-17.78; B9 2.54,-20.32; B10 2.54,-22.86; B11 2.54,-25.4; B12 2.54,-27.94; B13 2.54,-30.48; B14 2.54,-33.02; B15 2.54,-35.56; B16 2.54,-38.1; B17 2.54,-40.64; B18 2.54,-43.18; B19 2.54,-45.72; B20 2.54,-48.26; B21 2.54,-50.8; B22 2.54,-53.34; B23 2.54,-55.88; B24 2.54,-58.42; B25 2.54,-60.96; B26 2.54,-63.5; B27 2.54,-66.04; B28 2.54,-68.58; B29 2.54,-71.12; B30 2.54,-73.66; B31 2.54,-76.2; B32 2.54,-78.74; C1 0,0; C2 0,-2.54; C3 0,-5.08; C4 0,-7.62; C5 0,-10.16; C6 0,-12.7; C7 0,-15.24; C8 0,-17.78; C9 0,-20.32; C10 0,-22.86; C11 0,-25.4; C12 0,-27.94; C13 0,-30.48; C14 0,-33.02; C15 0,-35.56; C16 0,-38.1; C17 0,-40.64; C18 0,-43.18; C19 0,-45.72; C20 0,-48.26; C21 0,-50.8; C22 0,-53.34; C23 0,-55.88; C24 0,-58.42; C25 0,-60.96; C26 0,-63.5; C27 0,-66.04; C28 0,-68.58; C29 0,-71.12; C30 0,-73.66; C31 0,-76.2; C32 0,-78.74
LED5 = drill 0.9 pad 1.8: 1 2.54,0; 2 0,0
R_AXIAL = drill 0.8 pad 1.6: 1 0,0; 2 10.16,0
DIP16 = drill 0.813 pad 1.6: 1 0,0; 2 0,-2.54; 3 0,-5.08; 4 0,-7.62; 5 0,-10.16; 6 0,-12.7; 7 0,-15.24; 8 0,-17.78; 9 7.62,-17.78; 10 7.62,-15.24; 11 7.62,-12.7; 12 7.62,-10.16; 13 7.62,-7.62; 14 7.62,-5.08; 15 7.62,-2.54; 16 7.62,0
DIP20 = drill 0.813 pad 1.6: 1 0,0; 2 0,-2.54; 3 0,-5.08; 4 0,-7.62; 5 0,-10.16; 6 0,-12.7; 7 0,-15.24; 8 0,-17.78; 9 0,-20.32; 10 0,-22.86; 11 7.62,-22.86; 12 7.62,-20.32; 13 7.62,-17.78; 14 7.62,-15.24; 15 7.62,-12.7; 16 7.62,-10.16; 17 7.62,-7.62; 18 7.62,-5.08; 19 7.62,-2.54; 20 7.62,0
DIP14 = drill 0.813 pad 1.6: 1 0,0; 2 0,-2.54; 3 0,-5.08; 4 0,-7.62; 5 0,-10.16; 6 0,-12.7; 7 0,-15.24; 8 7.62,-15.24; 9 7.62,-12.7; 10 7.62,-10.16; 11 7.62,-7.62; 12 7.62,-5.08; 13 7.62,-2.54; 14 7.62,0

### Placement (x,y rotation side)
J1  147.32,88.9 0 top
LED3  15.24,96.52 0 top
LED4  35.56,96.52 0 top
LED5  55.88,96.52 0 top
R4  25.4,96.52 0 top
R5  45.72,96.52 0 top
RP1  5.08,96.52 0 top
U1  7.62,88.9 0 top
U2  21.59,88.9 0 top
U3  35.56,88.9 0 top
U4  49.53,88.9 0 top
U5  63.5,88.9 0 top
U6  77.47,88.9 0 top
U7  91.44,88.9 0 top
U8  105.41,88.9 0 top
U9  119.38,88.9 0 top
U10  133.35,88.9 0 top
U11  7.62,63.5 0 top
U12  21.59,63.5 0 top
U13  35.56,63.5 0 top
U14  49.53,63.5 0 top
U15  63.5,63.5 0 top
U16  77.47,63.5 0 top
U17  91.44,63.5 0 top
U18  105.41,63.5 0 top
U19  119.38,63.5 0 top
U20  133.35,63.5 0 top
U21  7.62,38.1 0 top
U22  21.59,38.1 0 top
U23  35.56,38.1 0 top
U24  49.53,38.1 0 top
U25  63.5,38.1 0 top
U26  77.47,38.1 0 top
U27  91.44,38.1 0 top
U28  105.41,38.1 0 top
U29  119.38,38.1 0 top
U30  133.35,38.1 0 top
U31  7.62,12.7 0 top
U32  21.59,12.7 0 top
U33  35.56,12.7 0 top
U34  49.53,12.7 0 top
U35  63.5,12.7 0 top
U36  77.47,12.7 0 top
U37  91.44,12.7 0 top
U38  105.41,12.7 0 top

### Tracks (layer width: path | path; a pad name or v marks a point on that pad's centre or on a via)
GND
  pour Route2 (isolate 0.3): 0,0 160,0 160,100 0,100
VCC
  pour Route15 (isolate 0.3): 0,0 160,0 160,100 0,100

### Text on the board
tPlace: P8X REGISTER BANK CARD REV A (P0=PC P3=SP)